# Altium schematic sheet interface.SchDoc
size A; SheetNumber: 3; SheetTotal: 4
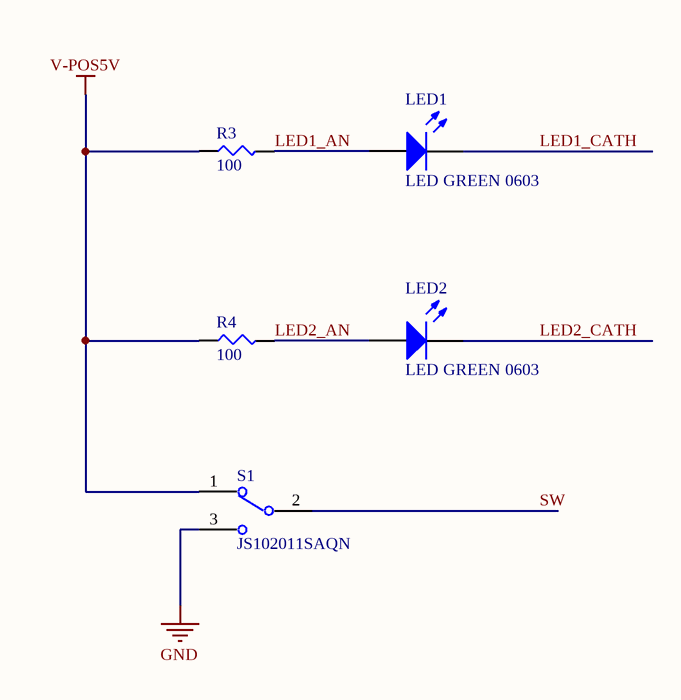
[diagram p0: interface.SchDoc]

## Parts
LED1  LED GREEN 0603  [LED 0603 GREEN]
LED2  LED GREEN 0603  [LED 0603 GREEN]
R3  100  [SMD-0805-RES]
R4  100  [SMD-0805-RES]
S1  JS102011SAQN  [SW_JS102011SAQN]

## Nets
GND: S1.3
V-POS5V: R3.1 R4.1 S1.1
LED1_AN: LED1.1(A) R3.2
LED1_CATH: LED1.2(K)
LED2_AN: LED2.1(A) R4.2
LED2_CATH: LED2.2(K)
SW: S1.2

## Library data of the parts
LED1 LED2 = LED GREEN 0603: Manufacturer: Lite-On Inc.; Manufacturer P/N: LTST-C190KGKT; Digikey P/N: 160-1435-1-ND; Package / Case: 0603; Color: GREEN
R3 R4 = ERJ-6ENF1000V: RES SMD 100 OHM 1% 1/8W 0805; Manufacturer: Panasonic Electronic Components; Factory Stock: 0; Unit Price (USD): 0.00729; @ qty: 1500; Minimum Quantity: 1; Power (Watts): 0.125W, 1/8W; Temperature Coefficient: ±100ppm/°C; Part Number: ERJ-6ENF1000V; Datasheets: http://industrial.panasonic.com/www-cgi/jvcr13pz.cgi?E+PZ+3+AOA0002+ERJ6ENF1000V+7+WW; Image: //media.digikey.com/Renders/Panasonic%20Renders/ERJ-0805%20Pkg.jpg; Digi-Key Part Number: P100CCT-ND; Quantity Available: 288663; Packaging: Cut Tape (CT); Series: ERJ; Part Status: Active; Value: 100; Tolerance: ±1%; Composition: Thick Film; Features: Automotive AEC-Q200; Operating Temperature: -55°C ~ 155°C; Package / Case: 0805 (2012 Metric); Supplier Device Package: 0805; Size / Dimension: 0.079" L x 0.049" W (2.00mm x 1.25mm); Height - Seated (Max): 0.028" (0.70mm); Number of Terminations: 2; Failure Rate: -
S1 = JS102011SAQN: Slide Switch SPDT Surface Mount, Right Angle; MF: C&K; Availability: Unavailable; Price: None; SnapEDA_Link: https://www.snapeda.com/parts/JS102011SAQN/C%26K/view-part/214325/?ref=snap; Value: *; MP: JS102011SAQN; Package: None